# EAGLE schematic esp8266_1D_noGND (EAGLE 7.5.0)
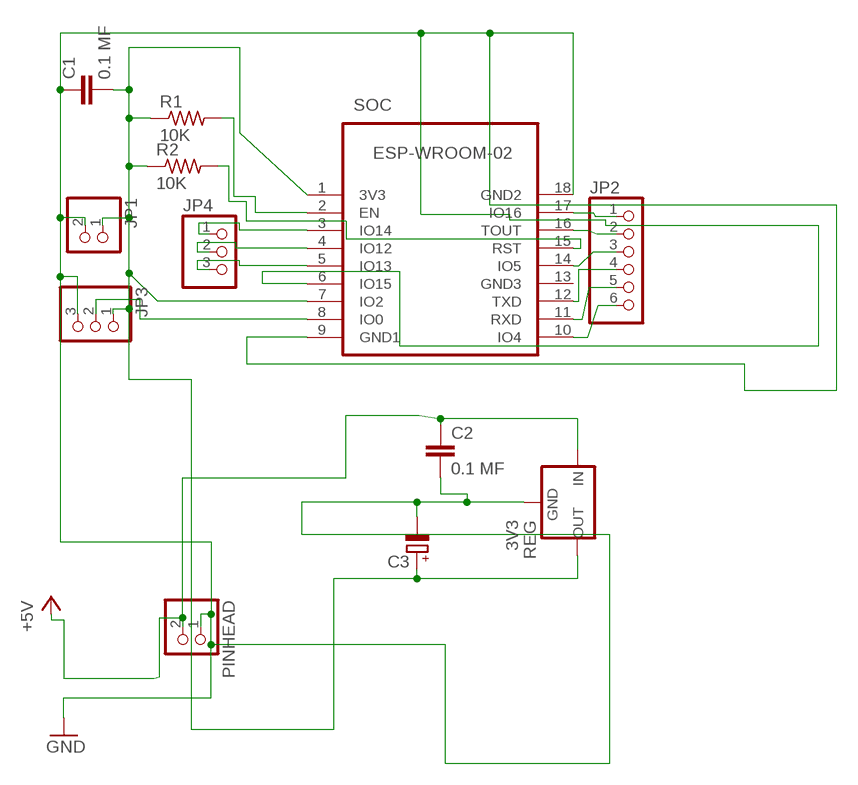
[diagram p0: schematic, sheet 1]

## Parts
C1  0.1 MF  C-EU025-024X044  [C025-024X044]
C2  0.1 MF  C-EU025-024X044  [C025-024X044]
C3  CPOL-EUE2.5-7  [E2,5-7]
JP1  PINHD-1X2  [1X02]
JP2  PINHD-1X6  [1X06]
JP3  PINHD-1X3  [1X03]
JP4  PINHD-1X3  [1X03]
PINHEAD  PINHD-1X2  [1X02]
R1  10K  R-US_0204/7  [0204/7]
R2  10K  R-US_0204/7  [0204/7]
REG  3V3  78XXS  [78XXS]
SOC  ESP-WROOM-02  ESP-WROOM-02-CP2FRONT  [FRONT-FACE-CP2]

## Nets
+5V: C2.1 PINHEAD.2 REG.IN
GND: C1.1 C2.2 C3.- JP1.2 JP3.3 PINHEAD.1 REG.GND SOC.6(IO15) SOC.9(GND1) SOC.18(GND2)
N$1: JP3.2 SOC.8(IO0)
N$2: JP4.1 SOC.3(IO14)
N$3: C1.2 C3.+ JP1.1 JP3.1 R1.1 R2.1 REG.OUT SOC.1(3V3) SOC.7(IO2)
N$4: JP4.2 SOC.4(IO12)
N$5: JP4.3 SOC.5(IO13)
N$6: JP2.1 SOC.17(IO16)
N$7: JP2.2 SOC.16(TOUT)
N$8: JP2.3 SOC.14(IO5)
N$9: JP2.4 SOC.12(TXD)
N$10: JP2.5 SOC.11(RXD)
N$11: JP2.6 SOC.10(IO4)
N$12: R1.2 SOC.2(EN)
N$13: R2.2 SOC.15(RST)
Unconnected: SOC.13(GND3)

## Library data of the parts
C1 C2 = rcl:C-EU: CAPACITOR, European symbol
C3 = rcl:CPOL-EU: POLARIZED CAPACITOR, European symbol
JP1 PINHEAD = pinhead:PINHD-1X2: PIN HEADER
JP2 = pinhead:PINHD-1X6: PIN HEADER
JP3 JP4 = pinhead:PINHD-1X3: PIN HEADER
R1 R2 = resistor:R-US_: RESISTOR, American symbol
REG = v-reg:78XXS: VOLTAGE REGULATOR
SOC = esp-wroom-02-CP2:ESP-WROOM-02-CP2: WiFi module - ESP-WROOM-02